# Altium schematic sheet RTC.SchDoc
size A
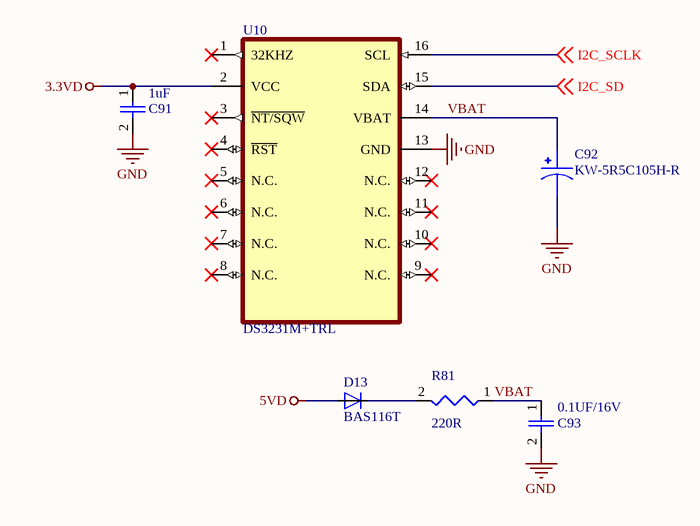
[diagram p0: RTC.SchDoc]

## Parts
C91  1uF  [0603-C]
C92  KW-5R5C105H-R  [CAPPRD500W80D2150H950]
C93  0.1UF/16V  [0603-C]
D13  BAS116T  [SOT416]
R81  220R  [0603-R]
U10  DS3231M+TRL  [SOIC127P1032X265-16N]

## Nets
3.3VD: C91.1 U10.2(VCC)
5VD: D13.1(A)
GND: C91.2 C92.2 C93.2 U10.13(GND)
I2C_SCLK: U10.16(SCL) ; off-sheet I2C_SCLK
I2C_SD: U10.15(SDA) ; off-sheet I2C_SD
VBAT: C92.1 C93.1 R81.1 U10.14(VBAT)
NetD13_3: D13.3(K) R81.2

Not connected (* = marked no-connect by the designer): U10 1(32KHZ)* 3(~{NT/SQW})* 4(~{RST})* 5(N.C.)* 6(N.C.)* 7(N.C.)* 8(N.C.)* 9(N.C.)* 10(N.C.)* 11(N.C.)* 12(N.C.)*

## Library data of the parts
C91 C93 = CAP
C92 = DK-6R3D105T: Supercapacitors 1F 5.5V; MF: Elna; Package: Radial Can  Elna; MP: DK-6R3D105T; Price: None; Value: *; Availability: Warning; SnapEDA_Link: https://www.snapeda.com/parts/DK-6R3D105T/Elna/view-part/810793/?ref=snap; Mouser-Purchase-URL: https://snapeda.com/shop?store=Mouser&id=810793
D13 = BAS116T: Diode Standard 75V 200mA Surface Mount SC-75, SOT-416; MP: BAS116; MF: NXP Semiconductors; Package: SOT-23-3 NXP Semiconductors; Availability: Bad; SnapEDA_Link: https://www.snapeda.com/parts/BAS116/NXP%20Semiconductors/view-part/188045/?ref=snap; Value: *; Price: None
R81 = Res
U10 = DS3231M+TRL: Package: None; Price: None; Value: *; MP: DS3231M+TRL; Availability: Unavailable